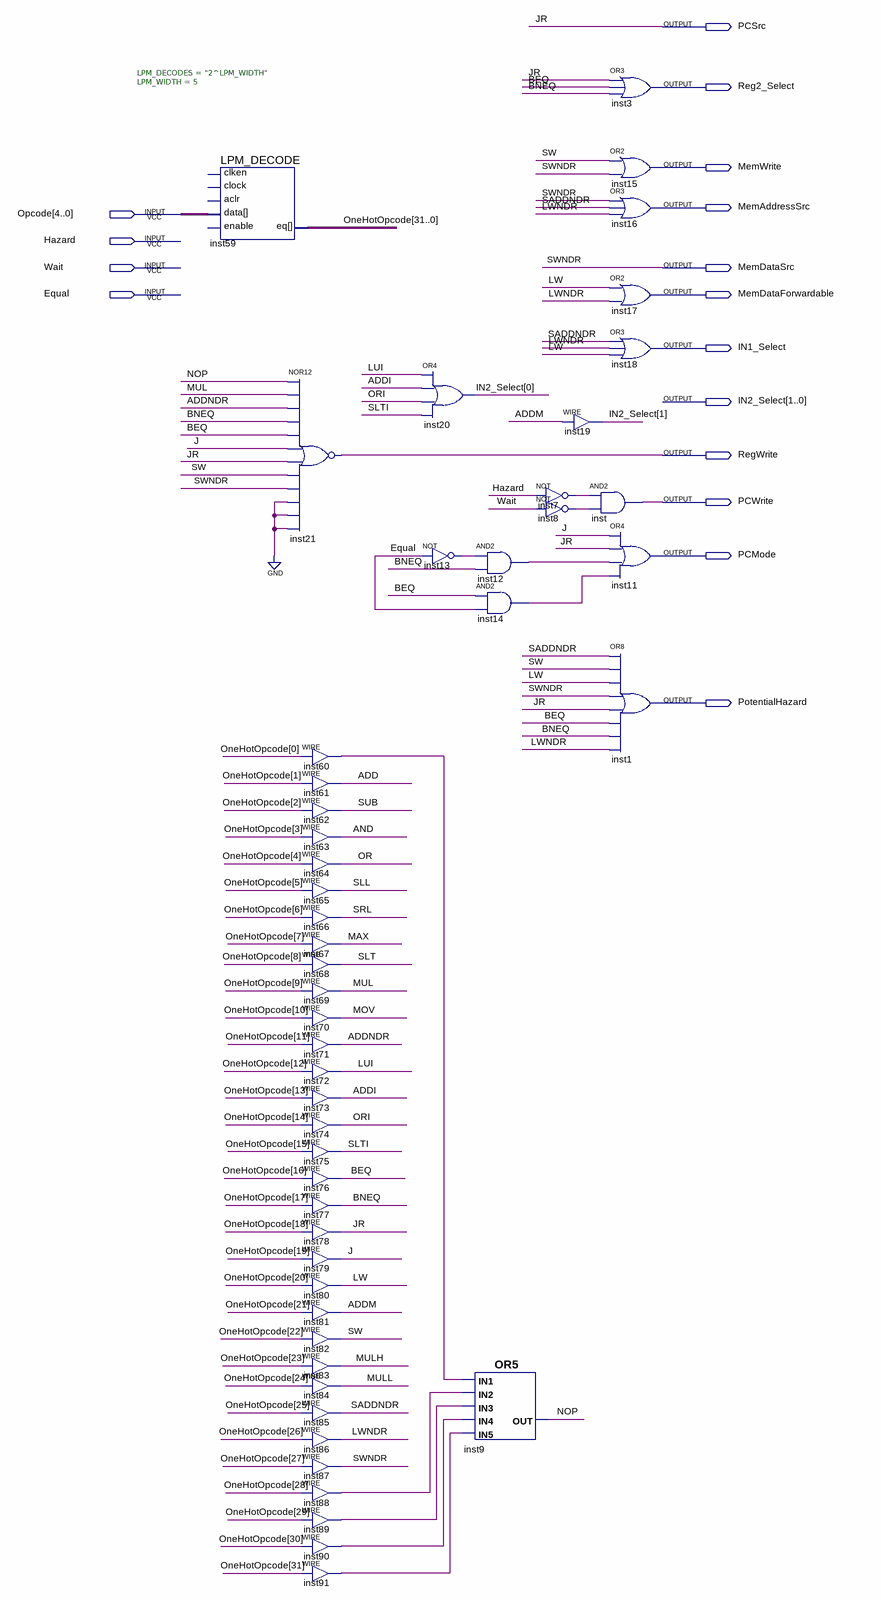
[diagram p0: schematic sheet]
// Quartus schematic ControlUnit.bdf as structural Verilog: 50 symbols, 16 pins
module ControlUnit (
  input  [4:0] Opcode,
  input  Hazard,
  input  Wait,
  input  Equal,
  output PCSrc,
  output Reg2_Select,
  output MemWrite,
  output MemAddressSrc,
  output MemDataSrc,
  output MemDataForwardable,
  output IN1_Select,
  output [1:0] IN2_Select,
  output RegWrite,
  output PCWrite,
  output PCMode,
  output PotentialHazard
);

  wire ADD, ADDI, ADDM, ADDNDR, AND, BEQ, BNEQ, inst7_out, inst8_out, inst12_out, inst13_out, inst14_out,
       inst60_out, inst88_out, inst89_out, inst90_out, inst91_out, J, LUI, LW, LWNDR, MAX, MOV, MUL, MULH,
       MULL, NOP, OR, ORI, SADDNDR, SLL, SLT, SLTI, SRL, SUB, SW;
  wire [31:0] OneHotOpcode;

  LPM_DECODE #(.LPM_DECODES("2^LPM_WIDTH"), .LPM_WIDTH(5)) inst59 (
    .data(Opcode), .eq(OneHotOpcode));  // open: enable, clken, clock, aclr
  nor inst21 (RegWrite, NOP, MUL, ADDNDR, BNEQ, BEQ, J, PCSrc, SW, MemDataSrc, 1'b0, 1'b0, 1'b0);
  assign inst60_out = OneHotOpcode[0];  // WIRE inst60
  assign ADD = OneHotOpcode[1];  // WIRE inst61
  assign SUB = OneHotOpcode[2];  // WIRE inst62
  assign AND = OneHotOpcode[3];  // WIRE inst63
  assign OR = OneHotOpcode[4];  // WIRE inst64
  assign SLL = OneHotOpcode[5];  // WIRE inst65
  assign SRL = OneHotOpcode[6];  // WIRE inst66
  assign MAX = OneHotOpcode[7];  // WIRE inst67
  assign SLT = OneHotOpcode[8];  // WIRE inst68
  assign MUL = OneHotOpcode[9];  // WIRE inst69
  assign MOV = OneHotOpcode[10];  // WIRE inst70
  assign ADDNDR = OneHotOpcode[11];  // WIRE inst71
  assign LUI = OneHotOpcode[12];  // WIRE inst72
  assign ADDI = OneHotOpcode[13];  // WIRE inst73
  assign ORI = OneHotOpcode[14];  // WIRE inst74
  assign SLTI = OneHotOpcode[15];  // WIRE inst75
  assign BEQ = OneHotOpcode[16];  // WIRE inst76
  assign BNEQ = OneHotOpcode[17];  // WIRE inst77
  assign PCSrc = OneHotOpcode[18];  // WIRE inst78
  assign J = OneHotOpcode[19];  // WIRE inst79
  assign LW = OneHotOpcode[20];  // WIRE inst80
  assign ADDM = OneHotOpcode[21];  // WIRE inst81
  assign SW = OneHotOpcode[22];  // WIRE inst82
  assign MULH = OneHotOpcode[23];  // WIRE inst83
  assign MULL = OneHotOpcode[24];  // WIRE inst84
  assign SADDNDR = OneHotOpcode[25];  // WIRE inst85
  assign LWNDR = OneHotOpcode[26];  // WIRE inst86
  assign MemDataSrc = OneHotOpcode[27];  // WIRE inst87
  assign inst88_out = OneHotOpcode[28];  // WIRE inst88
  assign inst89_out = OneHotOpcode[29];  // WIRE inst89
  assign inst90_out = OneHotOpcode[30];  // WIRE inst90
  assign inst91_out = OneHotOpcode[31];  // WIRE inst91
  or inst20 (IN2_Select[0], LUI, ADDI, ORI, SLTI);
  not inst13 (inst13_out, Equal);
  and inst12 (inst12_out, inst13_out, BNEQ);
  and inst14 (inst14_out, BEQ, Equal);
  or inst9 (NOP, inst60_out, inst88_out, inst89_out, inst90_out, inst91_out);
  not inst7 (inst7_out, Hazard);
  not inst8 (inst8_out, Wait);
  assign IN2_Select[1] = ADDM;  // WIRE inst19
  and inst (PCWrite, inst7_out, inst8_out);
  or inst3 (Reg2_Select, PCSrc, BEQ, BNEQ);
  or inst15 (MemWrite, SW, MemDataSrc);
  or inst16 (MemAddressSrc, MemDataSrc, SADDNDR, LWNDR);
  or inst17 (MemDataForwardable, LW, LWNDR);
  or inst18 (IN1_Select, SADDNDR, LWNDR, LW);
  or inst11 (PCMode, J, PCSrc, inst12_out, inst14_out);
  or inst1 (PotentialHazard, SADDNDR, SW, LW, MemDataSrc, PCSrc, BEQ, BNEQ, LWNDR);

  // Other names for the same wires on the sheet: JR = PCSrc; SWNDR = MemDataSrc
endmodule
